# Altium schematic sheet 23_PCIE 2.0 x1Lane RC_B_Key .SchDoc
size A3
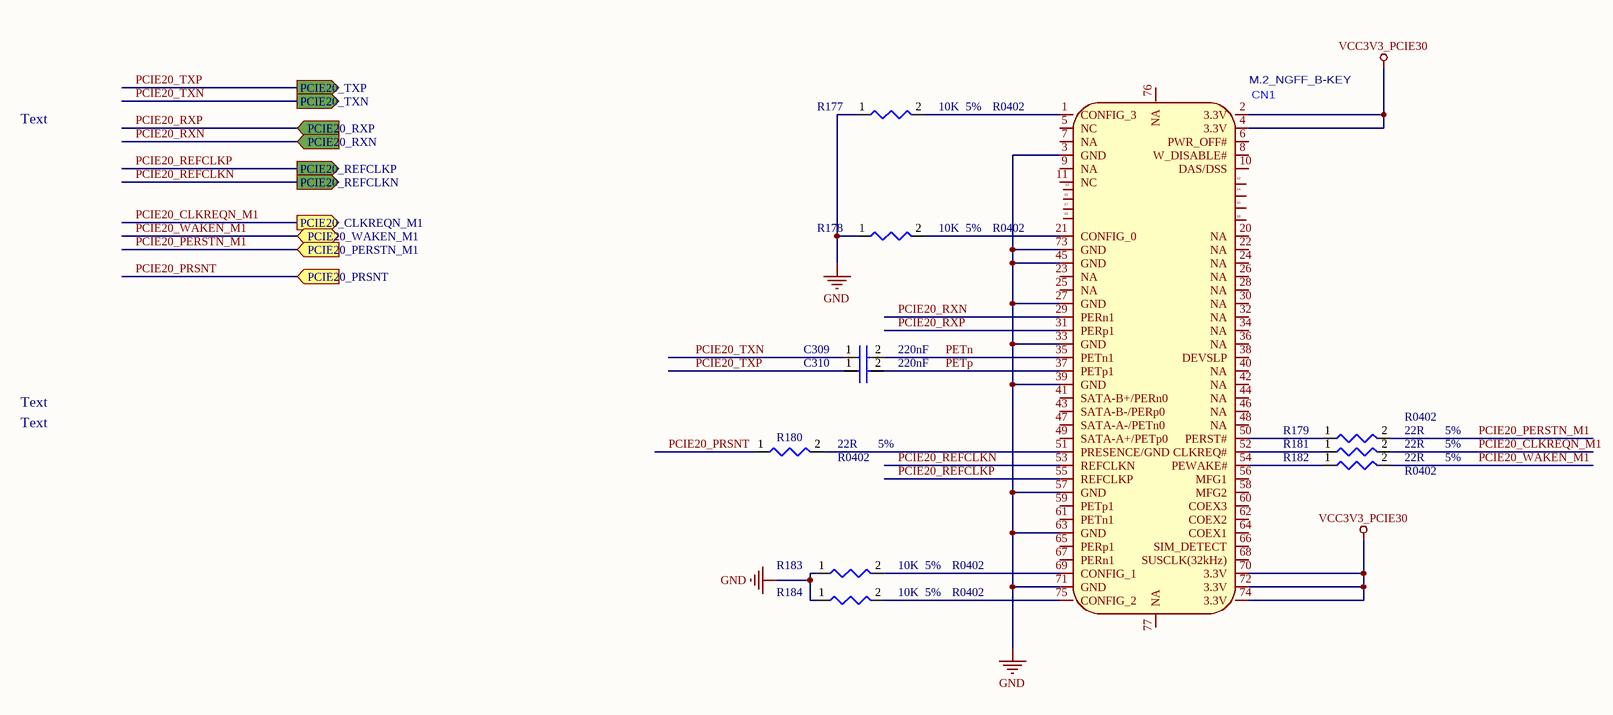
[diagram p0: 23_PCIE 2.0 x1Lane RC_B_Key .SchDoc]

## Parts
C309  220nF  [C0201]
C310  220nF  [C0201]
CN1  M.2_NGFF_B-KEY  [PCIE-SMD_TE_2199230-4]
R177  10K  Tolerance: 5%  [R0402]
R178  10K  Tolerance: 5%  [R0402]
R179  22R  Tolerance: 5%  [R0402]
R180  22R  Tolerance: 5%  [R0402]
R181  22R  Tolerance: 5%  [R0402]
R182  22R  Tolerance: 5%  [R0402]
R183  10K  Tolerance: 5%  [R0402]
R184  10K  Tolerance: 5%  [R0402]

## Ports
PCIE20_CLKREQN_M1 (out), PCIE20_PERSTN_M1 (in), PCIE20_PRSNT (in), PCIE20_REFCLKN (out), PCIE20_REFCLKP (out), PCIE20_RXN (in), PCIE20_RXP (in), PCIE20_TXN (out), PCIE20_TXP (out), PCIE20_WAKEN_M1 (bidir)

## Nets
GND: CN1.3(GND) CN1.27(GND) CN1.33(GND) CN1.39(GND) CN1.45(GND) CN1.57(GND) CN1.63(GND) CN1.71(GND) CN1.73(GND) R177.1 R178.1 R183.1 R184.1
VCC3V3_PCIE30: CN1.2(3.3V) CN1.4(3.3V) CN1.70(3.3V) CN1.72(3.3V) CN1.74(3.3V)
PCIE20_CLKREQN_M1: R181.2 ; port PCIE20_CLKREQN_M1
PCIE20_PERSTN_M1: R179.2 ; port PCIE20_PERSTN_M1
PCIE20_PRSNT: R180.1 ; port PCIE20_PRSNT
PCIE20_REFCLKN: CN1.53(REFCLKN) ; port PCIE20_REFCLKN
PCIE20_REFCLKP: CN1.55(REFCLKP) ; port PCIE20_REFCLKP
PCIE20_RXN: CN1.29(PERn1) ; port PCIE20_RXN
PCIE20_RXP: CN1.31(PERp1) ; port PCIE20_RXP
PCIE20_TXN: C309.1 ; port PCIE20_TXN
PCIE20_TXP: C310.1 ; port PCIE20_TXP
PCIE20_WAKEN_M1: R182.2 ; port PCIE20_WAKEN_M1
PETn: C309.2 CN1.35(PETn1)
PETp: C310.2 CN1.37(PETp1)
NetCN1_1: CN1.1(CONFIG_3) R177.2
NetCN1_21: CN1.21(CONFIG_0) R178.2
NetCN1_50: CN1.50(PERST#) R179.1
NetCN1_51: CN1.51(PRESENCE/GND) R180.2
NetCN1_52: CN1.52(CLKREQ#) R181.1
NetCN1_54: CN1.54(PEWAKE#) R182.1
NetCN1_69: CN1.69(CONFIG_1) R183.2
NetCN1_75: CN1.75(CONFIG_2) R184.2

Not connected (* = marked no-connect by the designer): CN1 5(NC) 6(PWR_OFF#) 7(NA) 8(W_DISABLE#) 9(NA) 10(DAS/DSS) 11(NC) 20(NA) 22(NA) 23(NA) 24(NA) 25(NA) 26(NA) 28(NA) 30(NA) 32(NA) 34(NA) 36(NA) 38(DEVSLP) 40(NA) 41(SATA-B+/PERn0) 42(NA) 43(SATA-B-/PERp0) 44(NA) 46(NA) 47(SATA-A-/PETn0) 48(NA) 49(SATA-A+/PETp0) 56(MFG1) 58(MFG2) 59(PETp1) 60(COEX3) 61(PETn1) 62(COEX2) 64(COEX1) 65(PERp1) 66(SIM_DETECT) 67(PERn1) 68(SUSCLK(32kHz)) 76(NA) 77(NA)

## Notes on the sheet
- Text
- (in symbol M.2_NGFF_B-KEY) 12; 13; 14; 15; 17; 16; 19; 18

## Library data of the parts
C309 C310 = CAP NP: cap,220.00nF,+/-10%,10V,X5R,C0201; Manufacturer PN: C0603X5R1A224K030BB; Manufacturer: TDK; Tolerance: 10%; Priority: A; Created by: JJJ; Part Type: C0201; RK PN: C0603X5R1A224K030BB
R177 R178 R183 R184 = RESISTOR_Dup1: 通用厚膜电阻,10K,+/-5%,R0402,1/16W.; Manufacturer: YAGEO; RK PN: RC0402JR-0710KL; Priority: A; Wattage: 1/16W; PCB Footprint: R0402; Part Type: 通用厚膜电阻; Manufacturer PN: RC0402JR-0710KL; Created by: YTL
R179-R182 = RESISTOR_Dup1: 通用厚膜电阻,22R,+/-5%,R0402,1/16W.; Manufacturer: YAGEO; RK PN: RC0402JR-0722RL; Priority: A; Wattage: 1/16W; PCB Footprint: R0402; Part Type: 通用厚膜电阻; Manufacturer PN: RC0402JR-0722RL; Created by: YTL